# EAGLE design tiny433mhz (EAGLE 7.2.0)
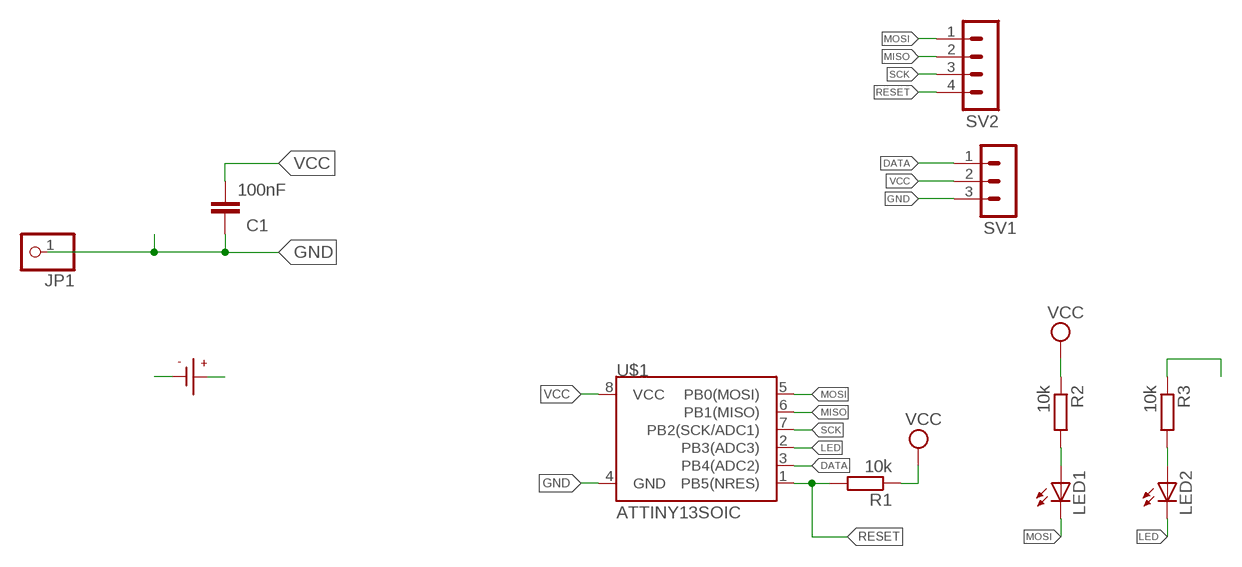
[diagram p0: schematic, sheet 1]

## Parts
C1  100nF  C-EUC0805  [C0805]
JP1  PINHD-1X1  [1X01]
LED1  LEDCHIP-LED0805  [CHIP-LED0805]
LED2  LEDCHIP-LED0805  [CHIP-LED0805]
R1  10k  R-EU_R0805  [R0805]
R2  10k  R-EU_R0805  [R0805]
R3  10k  R-EU_R0805  [R0805]
SV1  MA03-1  [MA03-1]
SV2  MA04-1  [MA04-1]
U$1  ATTINY13SOIC  [SO08]
U$3  CR2032  [CR2032-THT]

## Nets
DATA: SV1.1 U$1.3(PB4(ADC2))
GND: C1.1 JP1.1 R3.1 SV1.3 U$1.4(GND) U$3.-
LED: LED2.C U$1.2(PB3(ADC3))
MISO: SV2.2 U$1.6(PB1(MISO))
MOSI: LED1.C SV2.1 U$1.5(PB0(MOSI))
N$1: LED2.A R3.2
N$2: LED1.A R2.2
RESET: R1.2 SV2.4 U$1.1(PB5(NRES))
SCK: SV2.3 U$1.7(PB2(SCK/ADC1))
VCC: C1.2 R1.1 R2.1 SV1.2 U$1.8(VCC) U$3.+

## Library data of the parts
C1 = rcl:C-EU: CAPACITOR, European symbol
JP1 = adafruit:PINHD-1X1: Pin header 1x1 for 0.1" spacing With round pins
LED1 LED2 = adafruit:LED: LED OSRAM: - CHIPLED LG R971, LG N971, LY N971, LG Q971, LY Q971, LO R971, LY R971 LH N974, LH R974 LS Q976, LO Q976, LY Q976 LO Q996 - Hyper CHIPLED LW Q18S LB Q993, LB Q99A, LB R99A - SideLED LS A670, LO A670, LY A670, LG A670, LP A670 LB A673, LV A673, LT A673, LW A673 LH A674 LY A675 LS A676, LA A676, LO A676, LY A676, LW A676 LS A679, LY A679, LG A679 - Hyper Micro SIDELED® LS Y876, LA Y876, LO Y876, LY Y876 LT Y87S - SmartLED LW L88C, LW L88S LB L89C, LB L89S, LG L890 LS L89K, LO L89K, LY L89K LS L896, LA L896, LO L896, LY L896 - TOPLED LS T670, LO T670, LY T670, LG T670, LP T670 LSG T670, LSP T670, LSY T670, LOP T670, LYG T670 LG T671, LOG T671, LSG T671 LB T673, LV T673, LT T673, LW T673 LH T674 LS T676, LA T676, LO T676, LY T676, LB T676, LH T676, LSB T676, LW T676 LB T67C, LV T67C, LT T67C, LS T67K, LO T67K, LY T67K, LW E67C LS E67B, LA E67B, LO E67B, LY E67B, LB E67C, LV E67C, LT E67C LW T67C LS T679, LY T679, LG T679 LS T770, LO T770, LY T770, LG T770, LP T770 LB T773, LV T773, LT T773, LW T773 LH T774 LS E675, LA E675, LY E675, LS T675 LS T776, LA T776, LO T776, LY T776, LB T776 LHGB T686 LT T68C, LB T68C - Hyper Mini TOPLED® LB M676 - Mini TOPLED Santana® LG M470 LS M47K, LO M47K, LY M47K Source: http://www.osram.convergy.de/
R1-R3 = rcl:R-EU_: RESISTOR, European symbol
SV1 = con-lstb:MA03-1: PIN HEADER; OC_FARNELL: unknown; OC_NEWARK: unknown
SV2 = con-lstb:MA04-1: PIN HEADER; OC_FARNELL: unknown; OC_NEWARK: unknown
U$1 = SparkFun:ATTINY13
U$3 = _CR2032:CR2032

## Board
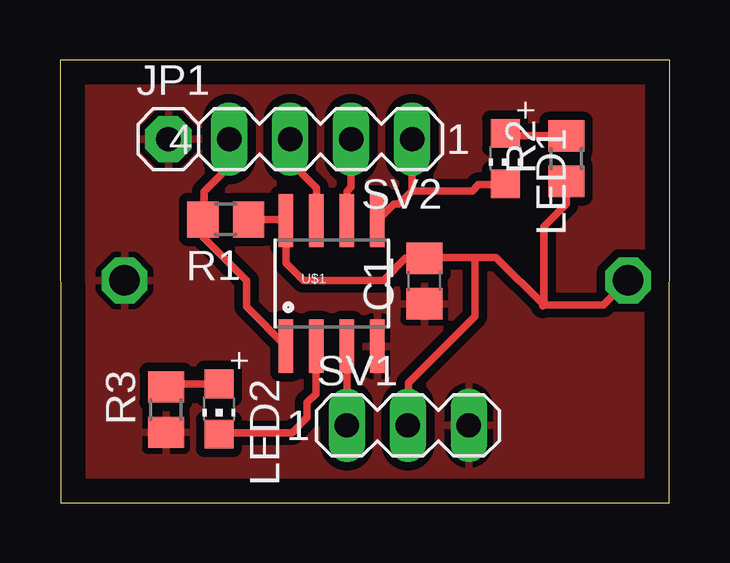
[diagram p1: board, top side]
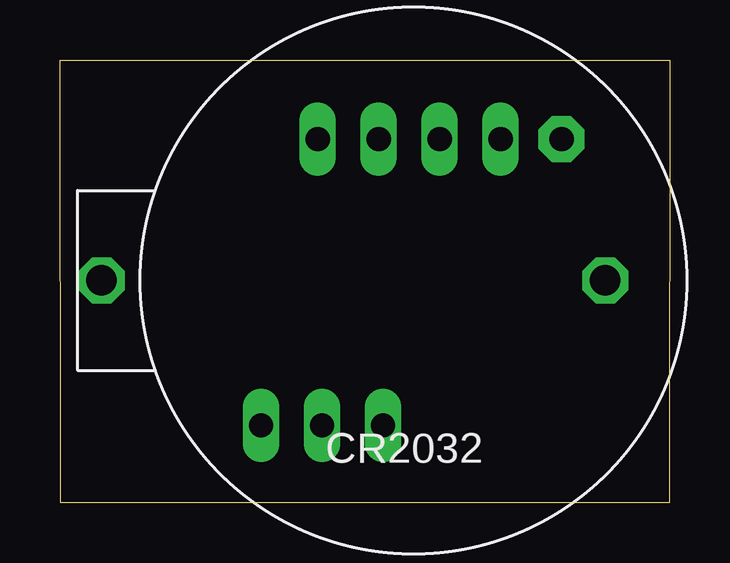
[diagram p2: board, bottom side, seen from below]

Size 25.43 x 18.47 mm. Coordinates in mm from the lower left corner, seen from the top.
Outline: 0.03,0 25.41,0 25.43,18.47 0,18.47 0.03,0
Copper layers (1*16): Top 0.035mm / dielectric 1.5mm / Bottom 0.035mm
Design rules "default": minimum track width 10mil, minimum drill 24mil, track to track 8mil, track to pad 8mil, pad to pad 8mil, via to via 8mil, smd to smd 8mil, copper to edge 40mil, drill to drill 8mil, minimum pad ring 10mil, minimum via ring 8mil, stop-mask expansion 4mil, vias tented up to drill 0mil, thermal gap 10mil

### Footprints (pad centres in the part's own frame; a part is rotated, then mirrored left to right if it is on the bottom)
C0805 = smd 1.3 x 1.5: 1 -0.95,0; 2 0.95,0
1X01 = drill 1.016 pad 1.93 octagon: 1 0,0
CHIP-LED0805 = smd 1.2 x 1.2: A 0,-1.05; C 0,1.05
R0805 = smd 1.3 x 1.5: 1 -0.95,0; 2 0.95,0
MA03-1 = drill 1.016 long: 1 -2.54,0; 2 0,0; 3 2.54,0
MA04-1 = drill 1.016 long: 1 -3.81,0; 2 -1.27,0; 3 1.27,0; 4 3.81,0
SO08 = smd 0.61 x 2.21: 1 -1.905,-2.616; 2 -0.635,-2.616; 3 0.635,-2.616; 4 1.905,-2.616; 5 1.905,2.616; 6 0.635,2.616; 7 -0.635,2.616; 8 -1.905,2.616
CR2032-THT = drill 1.27 octagon: + 12.11,0; - -8.89,0

### Placement (x,y rotation side)
C1  15.19,9.25 90 top
JP1  4.52,15.16 0 top
LED1  18.57,14.35 180 top
LED2  6.63,3.91 180 top
R1  6.91,11.81 180 top
R2  21.11,14.35 90 top
R3  4.42,3.89 90 top
SV1  14.5,3.23 0 top
SV2  10.87,15.16 180 top
U$1  11.33,9.14 0 top
U$3  11.58,9.27 180 bottom

### Tracks (layer width: path | path; a pad name or v marks a point on that pad's centre or on a via)
DATA
  Top 0.305: 11.94,6.5 U$1.3 SV1.1
GND
  pour Top (isolate 0.356): -1.12,19.43 26.19,19.43 26.19,-0.89 -0.48,-0.89
LED
  Top 0.305: 10.72,6.5 U$1.2 10.67,6.53 10.67,5.46 10.67,5.13 10.67,4.55 10.31,4.19 10.31,3.56 9.68,2.92 6.69,2.92 LED2.C
MISO
  Top 0.305: U$1.6 11.96,12.98 12.14,13.16 SV2.2
MOSI
  Top 0.305: U$1.5 13.92,12.45 14.12,12.45 14.68,13 | 14.68,13 SV2.1 | LED1.C 18.53,13.26 17.45,13.26 17.2,13 14.68,13
N$1
  Top 0.305: R3.2 4.55,4.96 LED2.A
N$2
  Top 0.305: LED1.A 18.67,15.3 R2.2
RESET
  Top 0.305: SV2.4 7.06,14.02 6.02,12.98 6.02,11.87 arc-90 R1.2 5.96,11.09 7.77,9.27 7.77,8.18 U$1.1
SCK
  Top 0.305: U$1.7 10.69,13.13 9.6,14.22 SV2.3
VCC
  Top 0.305: 17.3,10.24 15.23,10.24 C1.2 14.41,10.2 13.49,9.27 10.16,9.27 9.42,10.01 U$1.8 9.37,11.81 R1.1 | 17.3,10.24 18.19,10.24 20.18,8.25 | R2.1 21.11,12.45 20.18,11.52 20.18,8.25 | 21.01,8.25 21,8.25 | 21,8.25 20.18,8.25 | 20.18,8.25 20.13,8.2 | SV1.2 14.53,3.25 14.53,5 17.3,7.77 17.3,10.24 | U$3.+ 22.67,8.25 21,8.25